# Altium project SiLPA.PrjPCB (part 3 of 5)

## Sheet SiLPA_RF_channel.SchDoc: SiLPA
size 420 x 297 mm; EDA_Number: ARTIQ; Projet: Sampler; Author: G.Kasprowicz; CompanyName: WUT ISE; DrawnBy: G.Kasprowicz; Organization: WUT ISE; Address1: PW ISE; Address2: Nowowiejska 15/19 00-665 Warsaw; Address3: gkasprow@gmail.com; DocumentNumber: 3; Revision: 2; SheetNumber: 3; SheetTotal: 8; ModifiedBy: -; CheckedDate: -; Title2: Power stage; DivGrp: WUT ISE; Designer: G.Kasprowicz; ModifiedDate: -; ProjectName: Sensor Box
Used 2 times, as channels U_SiLPA_RF_channel0, U_SiLPA_RF_channel1. Parts and nets are listed once, with the designators drawn on the sheet.
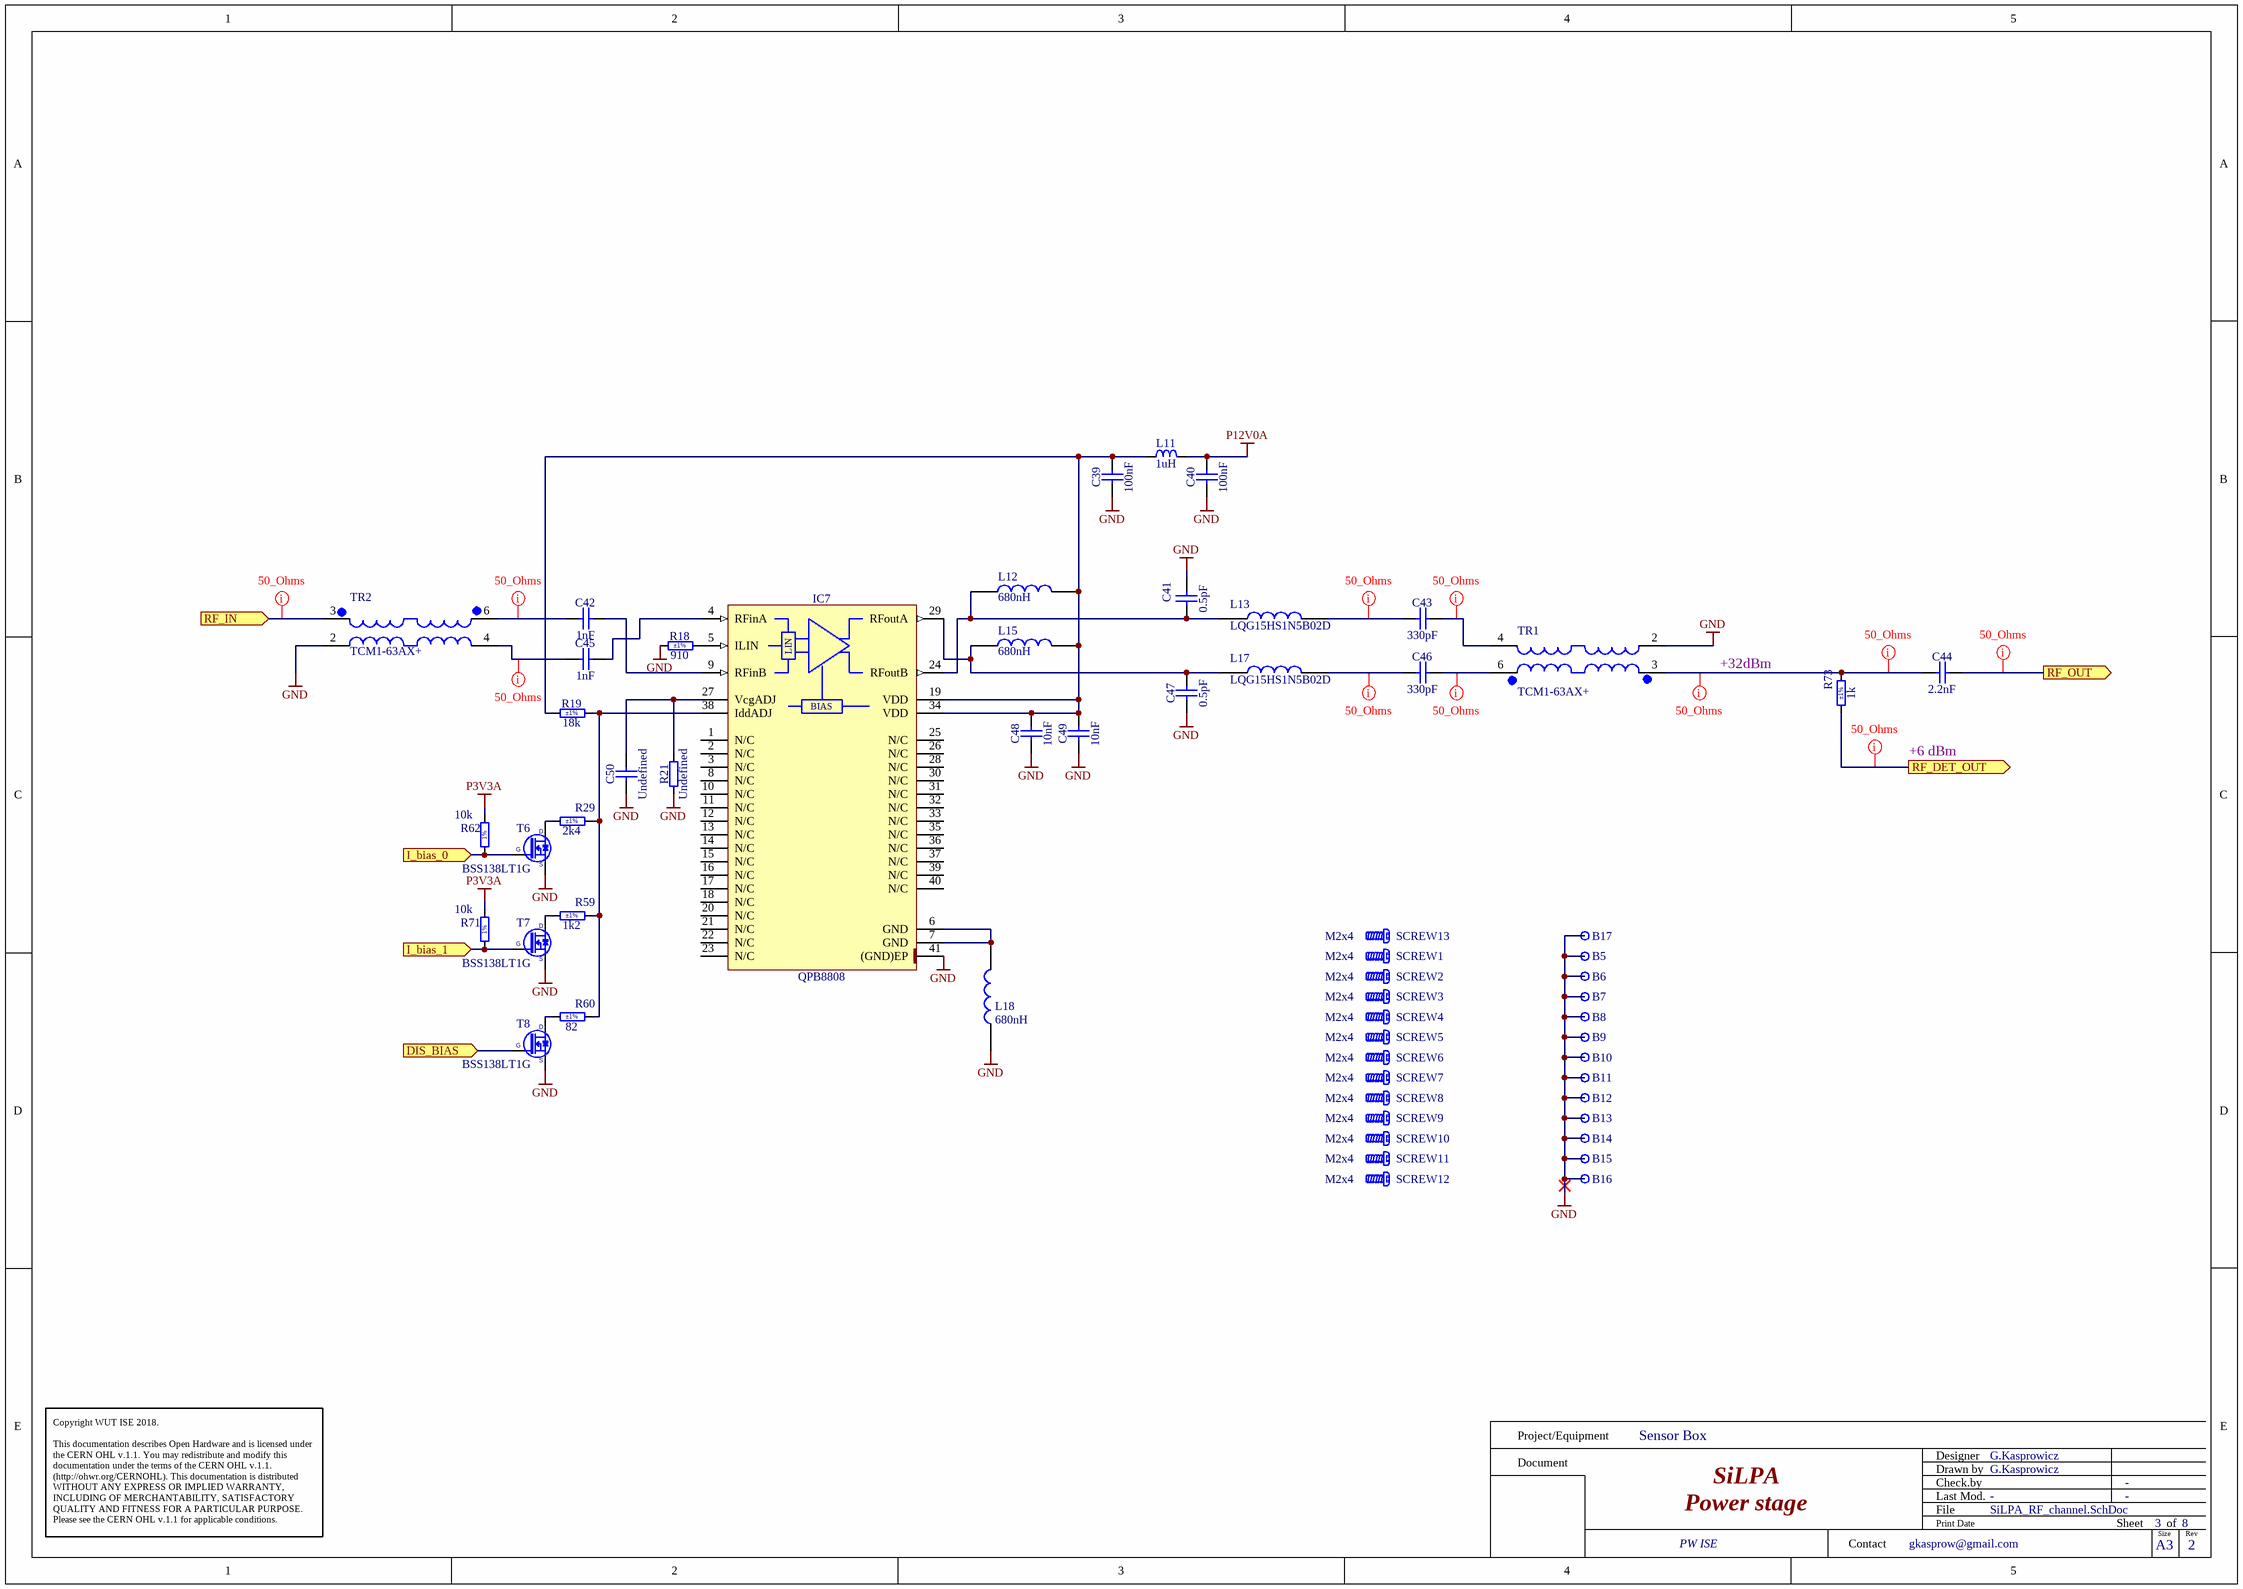
[diagram p3: SiLPA_RF_channel.SchDoc]

### Parts
B5  Plated Hole  [MTG240_400]  (value not drawn)  (no BOM)
B6  Plated Hole  [MTG240_400]  (value not drawn)  (no BOM)
B7  Plated Hole  [MTG240_400]  (value not drawn)  (no BOM)
B8  Plated Hole  [MTG240_400]  (value not drawn)  (no BOM)
B9  Plated Hole  [MTG240_400]  (value not drawn)  (no BOM)
B10  Plated Hole  [MTG240_400]  (value not drawn)  (no BOM)
B11  Plated Hole  [MTG240_400]  (value not drawn)  (no BOM)
B12  Plated Hole  [MTG240_400]  (value not drawn)  (no BOM)
B13  Plated Hole  [MTG240_400]  (value not drawn)  (no BOM)
B14  Plated Hole  [MTG240_400]  (value not drawn)  (no BOM)
B15  Plated Hole  [MTG240_400]  (value not drawn)  (no BOM)
B16  Plated Hole  [MTG240_400]  (value not drawn)  (no BOM)
B17  Plated Hole  [MTG240_400]  (value not drawn)  (no BOM)
C39  100nF  [CAPC1608X87N]
C40  100nF  [CAPC1608X87N]
C41  0.5pF  [CAPC1608X87N]
C42  1nF  [CAPC1608X90N]
C43  330pF  [CAPC1608X87N]
C44  2.2nF  [CAPC1608X87N]
C45  1nF  [CAPC1608X90N]
C46  330pF  [CAPC1608X87N]
C47  0.5pF  [CAPC1608X87N]
C48  10nF  [CAPC1608X87N]
C49  10nF  [CAPC1608X87N]
C50  Undefined  [CAPC1608X90N]
IC7  QPB8808  [QFN50P500X700X80-41N-R360X560]
L11  1uH  [INDC2012X110N]
L12  680nH  [0603AF681XJRW]
L13  LQG15HS1N5B02D  [LQG15WH0N7B02D]
L15  680nH  [0603AF681XJRW]
L17  LQG15HS1N5B02D  [LQG15WH0N7B02D]
L18  680nH  [0603AF681XJRW]
R18  910  Tolerance: ±1%  [RESC1608X55N]
R19  18k  Tolerance: ±1%  [RESC1005X40N]
R21  Undefined  [RESC1608X55N]
R29  2k4  Tolerance: ±1%  [RESC1005X40N]
R59  1k2  Tolerance: ±1%  [RESC1005X40N]
R60  82  Tolerance: ±1%  [RESC1005X40N]
R62  10k  [RESC1005X40N]
R71  10k  [RESC1005X40N]
R73  1k  Tolerance: ±1%  [RESC3216X65N]
SCREW1  M2x4  [BOSSARD_BN5687-3061579_v]
SCREW2  M2x4  [BOSSARD_BN5687-3061579_v]
SCREW3  M2x4  [BOSSARD_BN5687-3061579_v]
SCREW4  M2x4  [BOSSARD_BN5687-3061579_v]
SCREW5  M2x4  [BOSSARD_BN5687-3061579_v]
SCREW6  M2x4  [BOSSARD_BN5687-3061579_v]
SCREW7  M2x4  [BOSSARD_BN5687-3061579_v]
SCREW8  M2x4  [BOSSARD_BN5687-3061579_v]
SCREW9  M2x4  [BOSSARD_BN5687-3061579_v]
SCREW10  M2x4  [BOSSARD_BN5687-3061579_v]
SCREW11  M2x4  [BOSSARD_BN5687-3061579_v]
SCREW12  M2x4  [BOSSARD_BN5687-3061579_v]
SCREW13  M2x4  [BOSSARD_BN5687-3061579_v]
T6  BSS138LT1G  [SOT95P240X110-3N]
T7  BSS138LT1G  [SOT95P240X110-3N]
T8  BSS138LT1G  [SOT95P240X110-3N]
TR1  TCM1-63AX+  [XFMR_TCM1-63AX+]
TR2  TCM1-63AX+  [XFMR_TCM1-63AX+]

### Ports
DIS_BIAS (in), I_bias_0 (in), I_bias_1 (in), RF_DET_OUT (out), RF_IN (in), RF_OUT (out)

### Nets
GND: B5.1 B6.1 B7.1 B8.1 B9.1 B10.1 B11.1 B12.1 B13.1 B14.1 B15.1 B16.1 B17.1 C39.1 C40.1 C41.2 C47.1 C48.1 C49.1 C50.1 IC7.41((GND)EP) L18.1 R18.1 R21.1 T6.2(S) T7.2(S) T8.2(S) TR1.2 TR2.2
P3V3A: R62.2 R71.2
P12V0A: C40.2 L11.2
DIS_BIAS: T8.1(G) ; port DIS_BIAS
I_bias_0: R62.1 T6.1(G) ; port I_bias_0
I_bias_1: R71.1 T7.1(G) ; port I_bias_1
RF_DET_OUT: R73.1 ; port RF_DET_OUT
RF_IN: TR2.3 ; port RF_IN
RF_OUT: C44.2 ; port RF_OUT
NetC39_2: C39.2 C48.2 C49.2 IC7.19(VDD) IC7.34(VDD) L11.1 L12.2 L15.2 R19.1
NetC41_1: C41.1 IC7.24(RFoutB) L12.1 L13.1
NetC42_1: C42.1 TR2.6
NetC42_2: C42.2 IC7.9(RFinB)
NetC43_1: C43.1 L13.2
NetC43_2: C43.2 TR1.4
NetC44_1: C44.1 R73.2 TR1.3
NetC45_1: C45.1 TR2.4
NetC45_2: C45.2 IC7.4(RFinA)
NetC46_1: C46.1 L17.2
NetC46_2: C46.2 TR1.6
NetC47_2: C47.2 IC7.29(RFoutA) L15.1 L17.1
NetC50_2: C50.2 IC7.27(VcgADJ) R21.2
NetIC7_5: IC7.5(ILIN) R18.2
NetIC7_6: IC7.6(GND) IC7.7(GND) L18.2
NetIC7_38: IC7.38(IddADJ) R19.2 R29.2 R59.2 R60.2
NetR29_1: R29.1 T6.3(D)
NetR59_1: R59.1 T7.3(D)
NetR60_1: R60.1 T8.3(D)

Not connected (* = marked no-connect by the designer): IC7 1(N/C) 2(N/C) 3(N/C) 8(N/C) 10(N/C) 11(N/C) 12(N/C) 13(N/C) 14(N/C) 15(N/C) 16(N/C) 17(N/C) 18(N/C) 20(N/C) 21(N/C) 22(N/C) 23(N/C) 25(N/C) 26(N/C) 28(N/C) 30(N/C) 31(N/C) 32(N/C) 33(N/C) 35(N/C) 36(N/C) 37(N/C) 39(N/C) 40(N/C)

### Channels
U_SiLPA_RF_channel0: designators end in A; ports DIS_BIAS=NetIC24A_1 I_bias_0=I_bias0_0 I_bias_1=I_bias0_1 RF_DET_OUT=NetC52A_1 RF_IN=NetC16A_2 RF_OUT=NetC44A_2
U_SiLPA_RF_channel1: designators end in B; ports DIS_BIAS=NetIC24A_1 I_bias_0=I_bias1_0 I_bias_1=I_bias1_1 RF_DET_OUT=NetC52B_1 RF_IN=NetC16B_2 RF_OUT=NetC44B_2

### Layout directives
net class 50_Ohms: NetC16A_2, NetC42A_1, NetC43A_1, NetC43A_2, NetC44A_1, NetC44A_2, NetC45A_1, NetC46A_1, NetC46A_2, NetC52A_1

### Notes on the sheet
- +32dBm
- +6 dBm
- Project/Equipment
- Document
- Designer
- Drawn by
- Check.by
- Copyright WUT ISE 2018.
  This documentation describes Open Hardware and is licensed under the CERN OHL v.1.1. You may redistribute and modify this documentation under the terms of the CERN OHL v.1.1. (http://ohwr.org/CERNOHL). This documentation is distributed WITHOUT ANY EXPRESS OR IMPLIED WARRANTY, INCLUDING OF MERCHANTABILITY, SATISFACTORY QUALITY AND FITNESS FOR A PARTICULAR PURPOSE. Please see the CERN OHL v.1.1 for applicable conditions.
- Contact
- File
- Last Mod.
- Print Date
- Sheet
- Size
- A3
- of
- Rev
- (in symbol QPB8808) LIN; BIAS
- (in symbol R0402_10K_1%_0.0625W_100PPM) 1%

### Library data of the parts
B5-B17 = PLATED_HOLE2.4_PAD4.0: Single Terminal Socket; Part Description: Plated Through Hole: Hole Dia.=2.4mm Pad Dia.=4.0mm; Mounted: No; Part Number: PLATED_HOLE2.4_PAD4.0; Component Type: Standard (No BOM); Pin Count: 1; Family: Plated Hole; Socket: No; SMD: No; Sense: No; Status: None; ComponentHeight: 0mm; HelpURL: Undefined; Author: CERN DEM JMW; CreateDate: 10.10.2011; LatestRevisionDate: 10.10.2011; PackageDescription: Plated Through Hole: Hole Dia.=2.4mm Pad Dia.=4.0mm
C39 C40 = CC0603_100NF_50V_10%_X7R: Non-polarised capacitor; Part Description: SMD Multilayer Chip Ceramic Capacitor; Manufacturer: GENERIC; Manufacturer1 Part Number: 223858615649; Voltage: 50V; TC: X7R; Tolerance: ±10%; Part Number: CC0603_100NF_50V_10%_X7R; Component Kind: Standard; Component Type: Standard; Pin Count: 2; Value: 100nF; Status: Preferred; Manufacturer Part Number: CC0603_100NF_50V_10%_X7R; Case: 0603; Mounted: Yes; Socket: No; SMD: Yes; Sense: No; Manufacturer1 Example: PHYCOMP; Manufacturer1 ComponentHeight: 0.87mm; HelpURL: \\cern.ch\dfs\Applications\Altium\Datasheets\CC0603_X7R_PHYCOMP.pdf; Author: CERN DEM JLC; CreateDate: 03.12.2007; LatestRevisionDate: 03.12.2007
C41 C47 = CC0603_0.5PF_50V_WALSIN_HH18N0R5B500CT: Non-polarised capacitor; Part Description: SMD Multilayer Chip Ceramic Capacitor; Manufacturer: GENERIC; Voltage: 50V; TC: X7R; Tolerance: ±20%; Part Number: CC0603_0.5PF_50V; Component Kind: Standard; Component Type: Standard; Pin Count: 2; Value: 0.5pF; Status: None; Manufacturer Part Number: HH18N0R5B500CT; Case: 0603; Mounted: Yes; Socket: No; SMD: Yes; Sense: No; CreateDate: 22.06.2025; LatestRevisionDate: 22.06.2025; Manufacturer1 Example: WALSIN; Manufacturer1 Part Number: HH18N0R5B500CT; Manufacturer1 ComponentHeight: 0.9mm
C42 C45 = CC0603_1NF_50V_1%_NP0: Non-polarised capacitor; Part Description: SMD Multilayer Chip Ceramic Capacitor; Manufacturer: GENERIC; Manufacturer1 Part Number: 06035A102FAT2A; Voltage: 50V; TC: C0G/NP0; Tolerance: ±1%; Part Number: CC0603_1NF_50V_1%_NP0; Component Kind: Standard; Component Type: Standard; Pin Count: 2; Value: 1nF; Status: None; Manufacturer Part Number: CC0603_1NF_50V_1%_NP0; Case: 0603; Mounted: Yes; Socket: No; SMD: Yes; Sense: No; Manufacturer1 Example: AVX; Manufacturer1 ComponentHeight: 0.9mm; HelpURL: \\cern.ch\dfs\Applications\Altium\Datasheets\CC0603_C0G_AVX.pdf; Author: CERN DEM JLC; CreateDate: 15.06.2017; LatestRevisionDate: 15.06.2017
C43 C46 = CC0603_330PF_50V_1%_NP0: Non-polarised capacitor; Part Description: SMD Multilayer Chip Ceramic Capacitor; Manufacturer: GENERIC; Manufacturer1 Part Number: 223886718331; Voltage: 50V; TC: C0G/NP0; Tolerance: ±1%; Part Number: CC0603_330PF_50V_1%_NP0; Component Kind: Standard; Component Type: Standard; Pin Count: 2; Value: 330pF; Status: None; Manufacturer Part Number: CC0603_330PF_50V_1%_NP0; Case: 0603; Mounted: Yes; Socket: No; SMD: Yes; Sense: No; Manufacturer1 Example: PHYCOMP; Manufacturer1 ComponentHeight: 0.87mm; HelpURL: \\cern.ch\dfs\Applications\Altium\Datasheets\CC0603_NP0_PHYCOMP.pdf; Author: CERN DEM MR; CreateDate: 06.09.2017; LatestRevisionDate: 06.09.2017
C44 = CC0603_2.2NF_50V_5%_C0G: Non-polarised capacitor; Manufacturer: GENERIC; Part Description: SMD Multilayer Chip Ceramic Capacitor; Manufacturer1 Part Number: C1608C0G1H222J080AA; Voltage: 50V; TC: C0G/NP0; Tolerance: ±5%; Value: 2.2nF; Manufacturer Part Number: CC0603_2.2NF_50V_5%_C0G; Part Number: CC0603_2.2NF_50V_5%_C0G; Component Kind: Standard; Component Type: Standard; Pin Count: 2; Status: Preferred; Case: 0603; Mounted: Yes; Socket: No; SMD: Yes; Sense: No; Manufacturer1 Example: TDK; Manufacturer1 ComponentHeight: 0.9mm; HelpURL: \\cern.ch\dfs\Applications\Altium\Datasheets\CC0603_C0G_TDK_C.pdf; Author: CERN DEM JMW; CreateDate: 23.06.2014; LatestRevisionDate: 23.06.2014
C48 C49 = CC0603_10NF_50V_10%_X7R: Non-polarised capacitor; Part Description: SMD Multilayer Chip Ceramic Capacitor; Manufacturer: GENERIC; Manufacturer1 Part Number: 223858615636; Voltage: 50V; TC: X7R; Tolerance: ±10%; Part Number: CC0603_10NF_50V_10%_X7R; Component Kind: Standard; Component Type: Standard; Pin Count: 2; Value: 10nF; Status: Preferred; Manufacturer Part Number: CC0603_10NF_50V_10%_X7R; Case: 0603; Mounted: Yes; Socket: No; SMD: Yes; Sense: No; Manufacturer1 Example: PHYCOMP; Manufacturer1 ComponentHeight: 0.87mm; HelpURL: \\cern.ch\dfs\Applications\Altium\Datasheets\CC0603_X7R_PHYCOMP.pdf; Author: CERN DEM JLC; CreateDate: 03.12.2007; LatestRevisionDate: 03.12.2007
C50 = CC0603_NO-VALUE: Non-polarised capacitor; Part Description: Reserved Footprint For 0603(1608) Chip Ceramic Capacitor; Mounted: No; Part Number: CC0603_NO-VALUE; Component Kind: Standard; Component Type: Standard; Pin Count: 2; Value: Undefined; Status: None; Manufacturer: Undefined; Manufacturer Part Number: CC0603_NO-VALUE; Case: 0603; Socket: No; SMD: Yes; Sense: No; Manufacturer1 ComponentHeight: 0.9mm; HelpURL: Undefined; Author: CERN DEM MR; CreateDate: 22.11.2016; LatestRevisionDate: 22.11.2016
IC7 = QPB8808: 20 dB CATV +12V Power Doubler; Manufacturer: QORVO; PressFit: No; Bonding: No; Part Number: QPB8808; Component Kind: Standard; Component Type: Standard; Device: QPB8808; PackageDescription: QFN, 0.50mm Pitch, Square; 40 Pin, 5.00mm L X 7.00mm W X 0.80mm H body (w/Thermal Tab 3.60 X 5.60mm), IPC Medium Density; Part Description: 20 dB CATV +12V Power Doubler; Manufacturer Part Number: QPB8808; Pin Count: 41; Case: QFN40; Mounted: Yes; Socket: No; SMD: Yes; Sense: No; ComponentHeight: 0.8mm; Author: CERN DEM BC; HelpURL: \\cern.ch\dfs\Applications\Altium\Datasheets\QPB8808.pdf; CreateDate: 19.04.2021; LatestRevisionDate: 19.04.2021
L11 = IND0805_1UH_20%_WURTH_74479775210: Inductor; Part Description: SMD-Power Inductance (WE-PMI Series); Manufacturer: WURTH ELEKTRONIK; Power: 800mA; Resistance: 0.1R; Tolerance: ±20%; Part Number: IND0805_1UH_20%_WURTH_74479775210; Component Kind: Standard; Component Type: Standard; Pin Count: 2; Value: 1uH; Status: None; Manufacturer Part Number: 74479775210; Case: 0805; Mounted: Yes; Socket: No; SMD: Yes; Sense: No; ComponentHeight: 1.2mm; HelpURL: \\cern.ch\dfs\Applications\Altium\Datasheets\IND0805_WURTH_74479775210.pdf; Author: CERN DEM JLC; CreateDate: 10.10.2012; LatestRevisionDate: 08.04.2014
L12 L15 L18 = IND0603_COILCRAFT_AF-681XJRW: Fixed Inductors 1608 680nH Unshld 5% 490mA 460mOhms; Part Number: 0603AF-681XJRW; Part Description: RF Inductors - SMD; Resistance: 0.46R; Authors: skuchars; Tolerance: 5%; Footprint: 0603AF-681XJRW; Pin Count: 2; Value: 680nH; Power: 490mA; Manufacturer: COILCRAFT; Manufacturer Part Number: 0603AF-681XJRW; Case: 0603; Mounted: Yes; Socket: No; SMD: Yes; Sense: No; ComponentHeight: 0.91mm; HelpURL: https://www.coilcraft.com/getmedia/d1383945-8e89-4315-a3c0-59c445701e7e/0603af.pdf; CreateDate: 25.06.2025; LatestRevisionDate: 25.06.2025
L13 L17 = LQG15HS1N5B02D: LQG15HS_02 Series Inductor 1.5nH +/-0.1nH 0402 (1005); Part Description: RF Inductors - SMD 1.5nH +-.1nH; Manufacturer: Murata Electronics; Power: 1000mA; Resistance: 0.07; Tolerance: ±0.1nH; Authors: skuchars; Part Number: LQG15HS1N5B02D; Component Kind: Standard; Component Type: Standard; Footprint: LQG15HS1N5B02D; Pin Count: 2; Value: 1.5nH; Status: None; Manufacturer Part Number: LQG15HS1N5B02D; Case: 0402; Mounted: Yes; Socket: No; SMD: Yes; Sense: No; ComponentHeight: 0.6mm; HelpURL: https://search.murata.co.jp/Ceramy/image/img/P02/JELF243B-0010.pdf; CreateDate: 26.06.2025; LatestRevisionDate: 27.06.2025
R18 = R0603_910R_1%_0.1W_100PPM: Resistor - 1%; Part Description: General Purpose Thick Film Chip Resistor; Manufacturer: GENERIC; Manufacturer1 Part Number: NRC06F9100TRF; Power: 0.1W; TC: ±100ppm/°C; PressFit: No; Part Number: R0603_910R_1%_0.1W_100PPM; Component Kind: Standard; Component Type: Standard; Pin Count: 2; Value: 910; Status: Preferred; Manufacturer Part Number: R0603_910R_1%_0.1W_100PPM; Case: 0603; Mounted: Yes; Sense: No; Socket: No; SMD: Yes; Manufacturer1 Example: NIC COMPONENT; Manufacturer1 ComponentHeight: 0.55mm; HelpURL: \\cern.ch\dfs\Applications\Altium\Datasheets\R0603_NIC_NRC.pdf; Author: CERN DEM JLC; CreateDate: 03.12.2007; LatestRevisionDate: 13.03.2008
R19 = R0402_18K_1%_0.0625W_100PPM: Resistor - 1%; Part Description: General Purpose Thick Film Chip Resistor; Manufacturer: GENERIC; Manufacturer1 Part Number: 232270671803L; TC: ±100ppm/°C; PressFit: No; Part Number: R0402_18K_1%_0.0625W_100PPM; Component Kind: Standard; Component Type: Standard; Pin Count: 2; Value: 18k; Status: Not Recommended; Power: 0.0625W; Manufacturer Part Number: R0402_18K_1%_0.0625W_100PPM; Case: 0402; Mounted: Yes; Sense: No; Socket: No; SMD: Yes; Manufacturer1 Example: YAGEO PHYCOMP; Manufacturer1 ComponentHeight: 0.4mm; HelpURL: \\cern.ch\dfs\Applications\Altium\Datasheets\R0402_Phycomp_RC0402.pdf; Author: CERN DEM JLC; CreateDate: 03.12.2007; LatestRevisionDate: 17.10.2012
R21 = R0603_NO-VALUE: Resistor; Part Description: Reserved Footprint For a 0603 (1608) Chip Resistor; PressFit: No; Mounted: No; Part Number: R0603_NO-VALUE; Component Kind: Standard; Component Type: Standard; Pin Count: 2; Value: Undefined; Status: None; Manufacturer: Undefined; Manufacturer Part Number: R0603_NO-VALUE; Case: 0603; Sense: No; Socket: No; SMD: Yes; Manufacturer1 Example: Undefined; Manufacturer1 Part Number: Undefined; Manufacturer1 ComponentHeight: Undefined; HelpURL: Undefined; Author: CERN DEM JLC; CreateDate: 03.12.2007; LatestRevisionDate: 13.03.2008
R29 = R0402_2K4_1%_0.0625W_100PPM: Resistor - 1%; Part Description: General Purpose Thick Film Chip Resistor; Manufacturer: GENERIC; Manufacturer1 Part Number: 232270672402L; TC: ±100ppm/°C; PressFit: No; Part Number: R0402_2K4_1%_0.0625W_100PPM; Component Kind: Standard; Component Type: Standard; Pin Count: 2; Value: 2k4; Status: Not Recommended; Power: 0.0625W; Manufacturer Part Number: R0402_2K4_1%_0.0625W_100PPM; Case: 0402; Mounted: Yes; Sense: No; Socket: No; SMD: Yes; Manufacturer1 Example: YAGEO PHYCOMP; Manufacturer1 ComponentHeight: 0.4mm; HelpURL: \\cern.ch\dfs\Applications\Altium\Datasheets\R0402_Phycomp_RC0402.pdf; Author: CERN DEM JLC; CreateDate: 03.12.2007; LatestRevisionDate: 17.10.2012
R59 = R0402_1K2_1%_0.0625W_100PPM: Resistor - 1%; Part Description: General Purpose Thick Film Chip Resistor; Manufacturer: GENERIC; Manufacturer1 Part Number: 232270671202L; TC: ±100ppm/°C; PressFit: No; Part Number: R0402_1K2_1%_0.0625W_100PPM; Component Kind: Standard; Component Type: Standard; Pin Count: 2; Value: 1k2; Status: Not Recommended; Power: 0.0625W; Manufacturer Part Number: R0402_1K2_1%_0.0625W_100PPM; Case: 0402; Mounted: Yes; Sense: No; Socket: No; SMD: Yes; Manufacturer1 Example: YAGEO PHYCOMP; Manufacturer1 ComponentHeight: 0.4mm; HelpURL: \\cern.ch\dfs\Applications\Altium\Datasheets\R0402_Phycomp_RC0402.pdf; Author: CERN DEM JLC; CreateDate: 03.12.2007; LatestRevisionDate: 17.10.2012
R60 = R0402_82R_1%_0.0625W_100PPM: Resistor - 1%; Part Description: General Purpose Thick Film Chip Resistor; Manufacturer: GENERIC; Manufacturer1 Part Number: 232270678209L; TC: ±100ppm/°C; PressFit: No; Part Number: R0402_82R_1%_0.0625W_100PPM; Component Kind: Standard; Component Type: Standard; Pin Count: 2; Value: 82; Status: Not Recommended; Power: 0.0625W; Manufacturer Part Number: R0402_82R_1%_0.0625W_100PPM; Case: 0402; Mounted: Yes; Sense: No; Socket: No; SMD: Yes; Manufacturer1 Example: YAGEO PHYCOMP; Manufacturer1 ComponentHeight: 0.4mm; HelpURL: \\cern.ch\dfs\Applications\Altium\Datasheets\R0402_Phycomp_RC0402.pdf; Author: CERN DEM JLC; CreateDate: 03.12.2007; LatestRevisionDate: 17.10.2012
R62 R71 = R0402_10K_1%_0.0625W_100PPM: Resistor - 1%; Part Description: General Purpose Thick Film Chip Resistor; Manufacturer: GENERIC; Manufacturer1 Part Number: 232270671003L; TC: ±100ppm/°C; Table: Resistors SMD; Part Number: R0402_10K_1%_0.0625W_100PPM; Component Kind: Standard; Component Type: Standard; Pin Count: 2; Value: 10k; Status: Not recommended; Power: 0.0625W; Tolerance: ±1%; Manufacturer Part Number: R0402_10K_1%_0.0625W_100PPM; Case: 0402; Mounted: Yes; Socket: No; SMD: Yes; Manufacturer1 Example: YAGEO PHYCOMP; Manufacturer1 ComponentHeight: 0.4mm; HelpURL: \\cern.ch\dfs\Applications\Altium\Datasheets\R0402_Phycomp_RC0402.pdf; Author: CERN DEM JLC; CreateDate: 2007-12-03; LatestRevisionDate: 2012-10-17
R73 = R1206_1K_1%_0.25W_100PPM: Resistor - 1%; Part Description: General Purpose Thick Film Chip Resistor; Manufacturer: GENERIC; Manufacturer1 Part Number: NRC12F1001TRF; Power: 0.25W; TC: ±100ppm/°C; PressFit: No; Part Number: R1206_1K_1%_0.25W_100PPM; Component Kind: Standard; Component Type: Standard; Pin Count: 2; Value: 1k; Status: Preferred; Manufacturer Part Number: R1206_1K_1%_0.25W_100PPM; Case: 1206; Mounted: Yes; Sense: No; Socket: No; SMD: Yes; Manufacturer1 Example: NIC COMPONENT; Manufacturer1 ComponentHeight: 0.65mm; HelpURL: \\cern.ch\dfs\Applications\Altium\Datasheets\R1206_NIC_NRC.pdf; Author: CERN DEM JLC; CreateDate: 03.12.2007; LatestRevisionDate: 13.03.2008
SCREW1-SCREW13 = BOSSARD_BN5687-3061579_v: Screw; Part Description: M2 L=4mm Hexalobular Socket Pan Head Screw, Fully Threaded, Stainless Steel A2; Manufacturer Part Number: BN5687 Art.3061579; PressFit: No; Part Number: BOSSARD_BN5687-3061579_v; Component Kind: Standard; Component Type: Mechanical; Pin Count: 0; PackageDescription: M2 L=4mm Hexalobular Socket Pan Head Screw, Fully Threaded - Stainless Steel A2; Mounted: Yes; Socket: No; SMD: No; Sense: No; Status: None; Value: M2x4; Manufacturer: BOSSARD; ComponentHeight: 5.6mm; HelpURL: \\cern.ch\dfs\Applications\Altium\Datasheets\BOSSARD_BN5687-3061579.pdf; Author: CERN DEM JLC; CreateDate: 01.11.2018; LatestRevisionDate: 01.11.2018
T6-T8 = BSS138LT1G: N-CHANNEL MOSFET WITH DIODE; Part Description: 50V 200mA N-Channel Enhancement Mode Field-Effect Transistor; Manufacturer: ON SEMICONDUCTOR; PressFit: No; Bonding: No; Part Number: BSS138LT1G; Component Kind: Standard; Component Type: Standard; Device: BSS138LT1G; PackageDescription: SOT23, 0.95mm Pitch; 3 Pin, 1.40mm W X 3.00mm L X 1.10mm H body, IPC Medium Density; Manufacturer Part Number: BSS138LT1G; Pin Count: 3; Case: SOT23-3; Mounted: Yes; Socket: No; SMD: Yes; Sense: No; ComponentHeight: 1.11mm; HelpURL: \\cern.ch\dfs\Applications\Altium\Datasheets\BSS138LT1G.pdf; Author: CERN DEM JLC; CreateDate: 23.03.2009; LatestRevisionDate: 23.03.2009
TR1 TR2 = TCM1-63AX+: 1:1 CORE & WIRE Transformer, 10 - 6000 MHz, 50Ω; Manufacturer: Mini-Circuits; Power: 0.2W; Authors: skuchars; Manufacturer Part Number: TCM1-63AX+; Part Number: TCM1-63AX+; Component Kind: Standard; Component Type: Standard; Pin Count: 6; Value: 1:1; Status: None; Part Description: 1:1 CORE & WIRE Transformer, 10 - 6000 MHz, 50Ω; Mounted: Yes; Socket: No; Sense: No; SMD: Yes; ComponentHeight: 4.06mm; HelpURL: https://www.minicircuits.com/pdfs/TCM1-63AX+.pdf; CreateDate: 28.09.2025; LatestRevisionDate: 28.09.2025

## Sheet SiLPA_RF_channel_preamp.SchDoc: SiLPA
size 420 x 297 mm; EDA_Number: ARTIQ; Projet: Sampler; Author: G.Kasprowicz; CompanyName: WUT ISE; DrawnBy: G.Kasprowicz; Organization: WUT ISE; Address1: PW ISE; Address2: Nowowiejska 15/19 00-665 Warsaw; Address3: gkasprow@gmail.com; DocumentNumber: 2; Revision: 2; SheetNumber: 2; SheetTotal: 8; ModifiedBy: -; CheckedDate: -; Title2: Premplifier & switch; DivGrp: WUT ISE; Designer: G.Kasprowicz; ModifiedDate: -; ProjectName: Sensor Box
Used 2 times, as channels U_SiLPA_RF_channel_preamp0, U_SiLPA_RF_channel_preamp1. Parts and nets are listed once, with the designators drawn on the sheet.
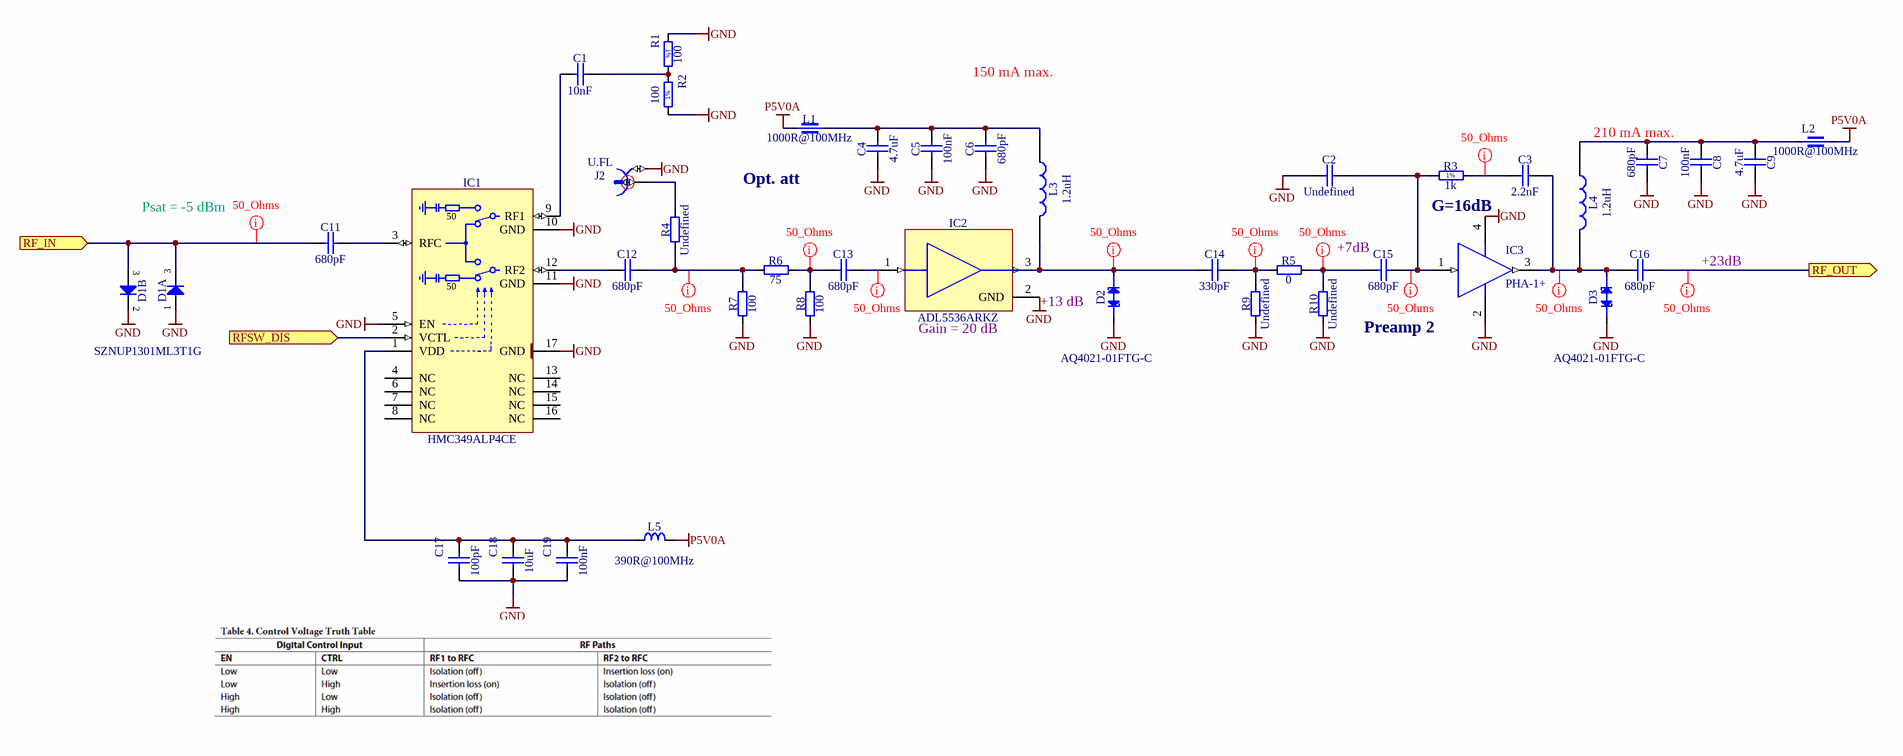
[diagram p4: SiLPA_RF_channel_preamp.SchDoc]

### Parts
C1  10nF  [CAPC1005X55N]
C2  Undefined  [CAPC1608X90N]
C3  2.2nF  [CAPC1608X87N]
C4  4.7uF  [CAPC1709X95N]
C5  100nF  [CAPC1608X87N]
C6  680pF  [CAPC1608X87N]
C7  680pF  [CAPC1608X87N]
C8  100nF  [CAPC1608X87N]
C9  4.7uF  [CAPC1709X95N]
C11  680pF  [CAPC1608X87N]
C12  680pF  [CAPC1608X87N]
C13  680pF  [CAPC1608X87N]
C14  330pF  [CAPC1608X87N]
C15  680pF  [CAPC1608X87N]
C16  680pF  [CAPC1608X87N]
C17  100pF  [CAPC1005X55N]
C18  10uF  [CAPC1608X80N]
C19  100nF  [CAPC1005X55N]
D1  SZNUP1301ML3T1G  [SOT95P240X110-3N]  (value not drawn)  (parts A,B of 2)
D2  AQ4021-01FTG-C  [SOD2513X114N]
D3  AQ4021-01FTG-C  [SOD2513X114N]
IC1  HMC349ALP4CE  [QFN65P400X400X100-17N-S255]
IC2  ADL5536ARKZ  [ANALOG-DEVICES_SOT-89(RK-3)]
IC3  PHA-1+  [MINI-CIRCUITS_DF782]
J2  U.FL  [HIROSE_U.FL-R-SMT-1(10)]
L1  1000R@100MHz  [INDC1608X95N]
L2  1000R@100MHz  [INDC1608X95N]
L3  1.2uH  [ADL2012S1R2MT01]
L4  1.2uH  [ADL2012S1R2MT01]
L5  390R@100MHz  [INDC1608X95N]
R1  100  [RESC1005X40N]
R2  100  [RESC1005X40N]
R3  1k  [RESC1608X55N]
R4  Undefined  [RESC1608X55N]
R5  0  [RESC1005X40N]
R6  75  [RESC1005X40N]
R7  100  [RESC1608X55N]
R8  100  [RESC1608X55N]
R9  Undefined  [RESC1608X55N]
R10  Undefined  [RESC1608X55N]

### Ports
RF_IN (in), RF_OUT (out), RFSW_DIS (in)

### Nets
GND: C2.1 C4.1 C5.1 C6.1 C7.1 C8.1 C9.1 C17.2 C18.1 C19.1 D1.1(A) D1.2(C) D2.1(C) D3.1(C) IC1.5(EN) IC1.10(GND) IC1.11(GND) IC1.17(GND) IC2.2(GND) IC3.2(GND) IC3.4(GND) J2.2 R1.1 R2.1 R7.1 R8.1 R9.1 R10.1
P5V0A: L1.1 L2.2 L5.2
RF_IN: C11.1 D1.3(COMAC) ; port RF_IN
RF_OUT: C16.2 ; port RF_OUT
RFSW_DIS: IC1.2(VCTL) ; port RFSW_DIS
NetC1_1: C1.1 IC1.9(RF1)
NetC1_2: C1.2 R1.2 R2.2
NetC2_2: C2.2 C15.2 IC3.1(RF_IN) R3.1
NetC3_1: C3.1 R3.2
NetC3_2: C3.2 C16.1 D3.2(A) IC3.3(RF_OUT) L4.2
NetC4_2: C4.2 C5.2 C6.2 L1.2 L3.1
NetC7_2: C7.2 C8.2 C9.2 L2.1 L4.1
NetC11_2: C11.2 IC1.3(RFC)
NetC12_1: C12.1 IC1.12(RF2)
NetC12_2: C12.2 R4.2 R6.1 R7.2
NetC13_1: C13.1 R6.2 R8.2
NetC13_2: C13.2 IC2.1(RFIN)
NetC14_1: C14.1 D2.2(A) IC2.3(RFOUT) L3.2
NetC14_2: C14.2 R5.1 R9.2
NetC15_1: C15.1 R5.2 R10.2
NetC17_1: C17.1 C18.2 C19.2 IC1.1(VDD) L5.1
NetJ2_1: J2.1 R4.1

Not connected (* = marked no-connect by the designer): IC1 4(NC) 6(NC) 7(NC) 8(NC) 13(NC) 14(NC) 15(NC) 16(NC)

### Channels
U_SiLPA_RF_channel_preamp0: designators end in A; ports RF_IN=NetC11A_1 RF_OUT=NetC16A_2 RFSW_DIS=RFSW_DIS0
U_SiLPA_RF_channel_preamp1: designators end in B; ports RF_IN=NetC11B_1 RF_OUT=NetC16B_2 RFSW_DIS=RFSW_DIS1

### Layout directives
net class 50_Ohm: NetJ2A_1
net class 50_Ohms: NetC2A_2, NetC3A_1, NetC3A_2, NetC11A_1, NetC12A_2, NetC13A_1, NetC13A_2, NetC14A_1, NetC14A_2, NetC15A_1, NetC16A_2

### Notes on the sheet
- 150 mA max.
- (near C7) 210 mA max.
- (near L1) Opt. att
- Psat = -5 dBm
- (near C15) +7dB
- G=16dB
- +23dB
- (near IC2) Gain = 20 dB
- +13 dB
- Preamp 2
- Project/Equipment
- Document
- Designer
- Drawn by
- Check.by
- Copyright WUT ISE 2018.
  This documentation describes Open Hardware and is licensed under the CERN OHL v.1.1. You may redistribute and modify this documentation under the terms of the CERN OHL v.1.1. (http://ohwr.org/CERNOHL). This documentation is distributed WITHOUT ANY EXPRESS OR IMPLIED WARRANTY, INCLUDING OF MERCHANTABILITY, SATISFACTORY QUALITY AND FITNESS FOR A PARTICULAR PURPOSE. Please see the CERN OHL v.1.1 for applicable conditions.
- Contact
- File
- Last Mod.
- Print Date
- Sheet
- Size
- A3
- of
- Rev
- (in symbol HMC349ALP4CE) 50
- (in symbol R0402_100R_1%_0.0625W_100PPM) 1%
- (in symbol R0603_1K_1%_0.1W_100PPM) 1%

### Library data of the parts
C1 = CC0402_10NF_16V_10%_X7R: Non-polarised capacitor; Part Description: SMD Multilayer Chip Ceramic Capacitor; Manufacturer: GENERIC; Manufacturer1 Part Number: 223878715636; Voltage: 16V; TC: X7R; Tolerance: ±10%; Part Number: CC0402_10NF_16V_10%_X7R; Component Kind: Standard; Component Type: Standard; Pin Count: 2; Value: 10nF; Status: Not Recommended; Manufacturer Part Number: CC0402_10NF_16V_10%_X7R; Case: 0402; Mounted: Yes; Socket: No; SMD: Yes; Sense: No; Manufacturer1 Example: PHYCOMP; Manufacturer1 ComponentHeight: 0.55mm; HelpURL: \\cern.ch\dfs\Applications\Altium\Datasheets\CC0402_X7R_PHYCOMP.pdf; Author: CERN DEM JLC; CreateDate: 2007-12-03; LatestRevisionDate: 2007-12-03
C2 = CC0603_NO-VALUE: as C50 on sheet SiLPA_RF_channel; Part Number: CC0603_NO-VALUE; Component Kind: Standard; Component Type: Standard; Pin Count: 2; Value: Undefined; Status: None; Manufacturer: Undefined; Manufacturer Part Number: CC0603_NO-VALUE; Case: 0603; Socket: No; SMD: Yes; Sense: No; Manufacturer1 ComponentHeight: 0.9mm; HelpURL: Undefined; Author: CERN DEM MR; CreateDate: 22.11.2016; LatestRevisionDate: 22.11.2016
C3 = CC0603_2.2NF_50V_5%_C0G: Non-polarised capacitor; Part Description: SMD Multilayer Chip Ceramic Capacitor; Manufacturer: GENERIC; Manufacturer1 Part Number: C1608C0G1H222J080AA; Voltage: 50V; TC: C0G/NP0; Tolerance: ±5%; Part Number: CC0603_2.2NF_50V_5%_C0G; Component Kind: Standard; Component Type: Standard; Pin Count: 2; Value: 2.2nF; Status: Preferred; Manufacturer Part Number: CC0603_2.2NF_50V_5%_C0G; Case: 0603; Mounted: Yes; Socket: No; SMD: Yes; Sense: No; Manufacturer1 Example: TDK; Manufacturer1 ComponentHeight: 0.9mm; HelpURL: \\cern.ch\dfs\Applications\Altium\Datasheets\CC0603_C0G_TDK_C.pdf; Author: CERN DEM JMW; CreateDate: 23.06.2014; LatestRevisionDate: 23.06.2014
C4 C9 = CC0603_4.7UF_16V_10%_X5R: Non-polarised capacitor; Manufacturer: GENERIC; Part Description: SMD Multilayer Chip Ceramic Capacitor; Manufacturer1 Part Number: EMK107ABJ475KA-T; Voltage: 16V; TC: X5R; Tolerance: ±10%; Value: 4.7uF; Manufacturer Part Number: CC0603_4.7UF_16V_10%_X5R; Part Number: CC0603_4.7UF_16V_10%_X5R; Component Kind: Standard; Component Type: Standard; Pin Count: 2; Status: None; Case: 0603; Mounted: Yes; Socket: No; SMD: Yes; Sense: No; Manufacturer1 Example: TAIYO YUDEN; Manufacturer1 ComponentHeight: 0.95mm; HelpURL: \\cern.ch\dfs\Applications\Altium\Datasheets\CC0603_X7R_TAIYO-YUDEN_HIGH-VALUE.pdf; Author: CERN DEM JLC; CreateDate: 16.12.2013; LatestRevisionDate: 16.09.2014
C5 C8 = CC0603_100NF_50V_10%_X7R: Non-polarised capacitor; Manufacturer: GENERIC; Part Description: SMD Multilayer Chip Ceramic Capacitor; Manufacturer1 Part Number: 223858615649; Voltage: 50V; TC: X7R; Tolerance: ±10%; Value: 100nF; Manufacturer Part Number: CC0603_100NF_50V_10%_X7R; Part Number: CC0603_100NF_50V_10%_X7R; Component Kind: Standard; Component Type: Standard; Pin Count: 2; Status: Preferred; Case: 0603; Mounted: Yes; Socket: No; SMD: Yes; Sense: No; Manufacturer1 Example: PHYCOMP; Manufacturer1 ComponentHeight: 0.87mm; HelpURL: \\cern.ch\dfs\Applications\Altium\Datasheets\CC0603_X7R_PHYCOMP.pdf; Author: CERN DEM JLC; CreateDate: 03.12.2007; LatestRevisionDate: 03.12.2007
C6 C11-C13 = CC0603_680PF_50V_5%_NP0: Non-polarised capacitor; Part Description: SMD Multilayer Chip Ceramic Capacitor; Manufacturer: GENERIC; Manufacturer1 Part Number: 223886715681; Voltage: 50V; TC: C0G/NP0; Tolerance: ±5%; Part Number: CC0603_680PF_50V_5%_NP0; Component Kind: Standard; Component Type: Standard; Pin Count: 2; Value: 680pF; Status: Preferred; Manufacturer Part Number: CC0603_680PF_50V_5%_NP0; Case: 0603; Mounted: Yes; Socket: No; SMD: Yes; Sense: No; Manufacturer1 Example: PHYCOMP; Manufacturer1 ComponentHeight: 0.87mm; HelpURL: \\cern.ch\dfs\Applications\Altium\Datasheets\CC0603_NP0_PHYCOMP.pdf; Author: CERN DEM JLC; CreateDate: 03.12.2007; LatestRevisionDate: 03.12.2007
C7 C15 C16 = CC0603_680PF_50V_5%_NP0: Non-polarised capacitor; Manufacturer: GENERIC; Part Description: SMD Multilayer Chip Ceramic Capacitor; Manufacturer1 Part Number: 223886715681; Voltage: 50V; TC: C0G/NP0; Tolerance: ±5%; Value: 680pF; Manufacturer Part Number: CC0603_680PF_50V_5%_NP0; Part Number: CC0603_680PF_50V_5%_NP0; Component Kind: Standard; Component Type: Standard; Pin Count: 2; Status: Preferred; Case: 0603; Mounted: Yes; Socket: No; SMD: Yes; Sense: No; Manufacturer1 Example: PHYCOMP; Manufacturer1 ComponentHeight: 0.87mm; HelpURL: \\cern.ch\dfs\Applications\Altium\Datasheets\CC0603_NP0_PHYCOMP.pdf; Author: CERN DEM JLC; CreateDate: 03.12.2007; LatestRevisionDate: 03.12.2007
C14 = CC0603_330PF_50V_1%_NP0: Non-polarised capacitor; Manufacturer: GENERIC; Part Description: SMD Multilayer Chip Ceramic Capacitor; Manufacturer1 Part Number: 223886718331; Voltage: 50V; TC: C0G/NP0; Tolerance: ±1%; Value: 330pF; Manufacturer Part Number: CC0603_330PF_50V_1%_NP0; Part Number: CC0603_330PF_50V_1%_NP0; Component Kind: Standard; Component Type: Standard; Pin Count: 2; Status: None; Case: 0603; Mounted: Yes; Socket: No; SMD: Yes; Sense: No; Manufacturer1 Example: PHYCOMP; Manufacturer1 ComponentHeight: 0.87mm; HelpURL: \\cern.ch\dfs\Applications\Altium\Datasheets\CC0603_NP0_PHYCOMP.pdf; Author: CERN DEM MR; CreateDate: 06.09.2017; LatestRevisionDate: 06.09.2017
C17 = CC0402_100PF_50V_5%_C0G: Non-polarised capacitor; Part Description: SMD Multilayer Chip Ceramic Capacitor; Manufacturer: GENERIC; Manufacturer1 Part Number: C0402C101J5GACTU; Voltage: 50V; TC: C0G/NP0; Tolerance: ±5%; Part Number: CC0402_100PF_50V_5%_C0G; Component Kind: Standard; Component Type: Standard; Pin Count: 2; Value: 100pF; Status: Preferred; Manufacturer Part Number: CC0402_100PF_50V_5%_C0G; Case: 0402; Mounted: Yes; Socket: No; SMD: Yes; Sense: No; Manufacturer1 Example: KEMET; Manufacturer1 ComponentHeight: 0.55mm; HelpURL: \\cern.ch\dfs\Applications\Altium\Datasheets\CC0805_C0G_KEMET_(Commercial Grade).pdf; Author: CERN DEM JLC; CreateDate: 2007-12-03; LatestRevisionDate: 2015-04-22
C18 = CC0603_10UF_16V_20%_X5R: Non-polarised capacitor; Part Description: SMD Multilayer Chip Ceramic Capacitor; Manufacturer: GENERIC; Manufacturer1 Part Number: GRM188R61C106MA73D; Voltage: 16V; TC: X5R; Tolerance: ±20%; Part Number: CC0603_10UF_16V_20%_X5R; Component Kind: Standard; Component Type: Standard; Pin Count: 2; Value: 10uF; Status: None; Manufacturer Part Number: CC0603_10UF_16V_20%_X5R; Case: 0603; Mounted: Yes; Socket: No; SMD: Yes; Sense: No; Manufacturer1 Example: MURATA; Manufacturer1 ComponentHeight: 0.8mm; HelpURL: \\cern.ch\dfs\Applications\Altium\Datasheets\CC0603_X5R_MURATA_GRM.pdf; Author: CERN DEM MR; CreateDate: 2016-03-02; LatestRevisionDate: 2016-03-02
C19 = CC0402_100NF_16V_10%_X5R: Non-polarised capacitor; Part Description: SMD Multilayer Chip Ceramic Capacitor; Manufacturer: GENERIC; Manufacturer1 Part Number: GRM155R61C104KA88D; Voltage: 16V; TC: X5R; Tolerance: ±10%; Part Number: CC0402_100NF_16V_10%_X5R; Component Kind: Standard; Component Type: Standard; Pin Count: 2; Value: 100nF; Status: None; Manufacturer Part Number: CC0402_100NF_16V_10%_X5R; Case: 0402; Mounted: Yes; Socket: No; SMD: Yes; Sense: No; Manufacturer1 Example: MURATA; Manufacturer1 ComponentHeight: 0.55mm; HelpURL: \\cern.ch\dfs\Applications\Altium\Datasheets\CC0402_X5R_MURATA_GRM.pdf; Author: CERN DEM JLC; CreateDate: 10.12.2013; LatestRevisionDate: 10.12.2013
D1 = D_TVS_SZNUP1301ML3T1G: Low Capacitance Diode Array for ESD Protection in a Single Data Line; Manufacturer: ONSEMI; Voltage: 70V; Power: 215mA; PressFit: No; Bonding: No; Part Number: SZNUP1301ML3T1G; Component Kind: Standard; Component Type: Standard; Device: SZNUP1301ML3T1G; PackageDescription: SOT23 3-Leads, Pitch 0.95mm - Body 1.3x2.9mm, IPC Medium Density; Part Description: Low Capacitance Diode Array for ESD Protection in a Single Data Line; Manufacturer Part Number: SZNUP1301ML3T1G; Pin Count: 3; Case: SOT23; Mounted: Yes; Socket: No; SMD: Yes; Sense: No; ComponentHeight: 1.1mm; HelpURL: \\cern.ch\dfs\Applications\Altium\Datasheets\BAR66.pdf; Author: GK; CreateDate: 18.01.2010; LatestRevisionDate: 05.10.2010
D2 D3 = D_TVS_AQ4021-01FTG-C: 6V Bi-directional,ESD Protection for Transient Voltage Suppressor Diode; Part Description: Bi-directional ESD Protection for Transient Voltage Suppressor Diode; Manufacturer: Littlefuse; Power: 450W; PressFit: No; Bonding: No; Part Number: AQ4021-01FTG-C; Component Kind: Standard; Component Type: Standard; Device: AQ4021-01FTG-C; PackageDescription: SOD-323 Diode; 1.75mm W X 1.30mm L X 1.14mm H Body, IPC Medium Density; Voltage: 6V; Manufacturer Part Number: AQ4021-01FTG-C; Pin Count: 2; Case: SOD323; Mounted: Yes; Socket: No; SMD: Yes; Sense: No; ComponentHeight: 1.14mm; HelpURL: \\cern.ch\dfs\Applications\Altium\Datasheets\CDSOD323-T12C-DSL.pdf; Author: GK; CreateDate: 22.07.2015; LatestRevisionDate: 19.12.2017
IC1 = HMC349ALP4CE: DC-4GHz High Isolation SPDT Non-Reflective Switch; Manufacturer: ANALOG DEVICES; PressFit: No; Bonding: No; Part Number: HMC349ALP4CE; Component Kind: Standard; Component Type: Standard; Device: HMC349ALP4CE; PackageDescription: QFN, 0.65mm pitch,square; 4 pin X 4 pin, 4mm X 4mm X 1mm H body (w/thermal tab 2.55 X 2.55mm),  IPC Medium Density; Part Description: DC-4GHz High Isolation SPDT Non-Reflective Switch; Manufacturer Part Number: HMC349ALP4CE; Pin Count: 17; Case: QFN16; Mounted: Yes; Socket: No; SMD: Yes; Sense: No; ComponentHeight: 1mm; Author: CERN DEM JLC; HelpURL: \\cern.ch\dfs\Applications\Altium\Datasheets\HMC349ALP4CE.pdf; CreateDate: 23.02.2017; LatestRevisionDate: 23.02.2017
IC2 = ADL5536ARKZ: 20MHz to 1GHz IF Gain Block; Manufacturer: ANALOG DEVICES; PressFit: No; Bonding: No; Part Number: ADL5536ARKZ; Component Kind: Standard; Component Type: Standard; Device: ADL5536ARKZ; PackageDescription: SOT89, 1.50mm Pitch; 3-Leads, 2.5mm W X 4.5mm L X 1.6mm H body; Part Description: 20MHz to 1GHz IF Gain Block; Manufacturer Part Number: ADL5536ARKZ; Pin Count: 4; Case: SOT89; Mounted: Yes; Socket: No; SMD: Yes; Sense: No; ComponentHeight: 1.6mm; Author: CERN DEM BC; HelpURL: \\cern.ch\dfs\Applications\Altium\Datasheets\ADL5536ARKZ.pdf; CreateDate: 19.08.2019; LatestRevisionDate: 19.08.2019
IC3 = PHA-1+: Monolithic Amplifier; Part Description: 0.05-6GHz Surface Mount Monolithic Amplifier; Manufacturer: MINI-CIRCUITS; PressFit: No; Bonding: No; Part Number: PHA-1+; Component Kind: Standard; Component Type: Standard; Device: PHA-1+; PackageDescription: MINI-CIRCUITS DF782 Case, 1.50mm pitch; 4 pin, 2.44mm W X 4.49mm L; Manufacturer Part Number: PHA-1+; Pin Count: 4; Mounted: Yes; Socket: No; SMD: Yes; Sense: No; ComponentHeight: 1.6mm; Author: CERN DEM BC; HelpURL: \\cern.ch\dfs\Applications\Altium\Datasheets\PHA-1+.pdf; CreateDate: 22.08.2019; LatestRevisionDate: 22.08.2019
J2 = HIROSE_U.FL-R-SMT-1(10): Part Description: Up to 6GHz Ultra Small Surface Mount Male Coaxial Connectors U.FL Series; Manufacturer: HIROSE (HRS); PressFit: No; Part Number: HIROSE_U.FL-R-SMT-1(10); Component Kind: Standard; Component Type: Standard; Pin Count: 2; Family: U.FL; Mounted: Yes; Socket: No; SMD: Yes; Sense: No; Status: None; Manufacturer Part Number: U.FL-R-SMT-1(10); ComponentHeight: 1.25mm; HelpURL: \\cern.ch\dfs\Applications\Altium\Datasheets\HIROSE_U.FL-R-SMT-1(10).pdf; Author: CERN DEM JLC; CreateDate: 24.03.2010; LatestRevisionDate: 24.03.2010
L1 L2 = IND0603_MURATA_BLM18HE102SN1: Manufacturer: MURATA; Part Description: SMD EMIFIL Suppression Chip Ferrite Bead; Power: 600mA; Resistance: 0.35R; Tolerance: ±25%; Value: 1000R@100MHz; Manufacturer Part Number: BLM18HE102SN1; Part Number: IND0603_MURATA_BLM18HE102SN1; Component Kind: Standard; Component Type: Standard; Pin Count: 2; Status: None; Case: 0603; Mounted: Yes; Socket: No; SMD: Yes; Sense: No; ComponentHeight: 0.95mm; HelpURL: \\cern.ch\dfs\Applications\Altium\Datasheets\IND0603_MURATA_BLM18H.pdf; Author: CERN DEM JLC; CreateDate: 09.12.2013; LatestRevisionDate: 25.10.2018
L3 L4 = ADL2012S-1R2M-T01: 1.2uH Unshielded Drum Core, Wirewound Inductor 550 mA 500mOhm Max 0808 (2012 Metric); Part Number: 810-ADL2012S-1R2MT01; Part Description: Power Inductors - SMD 1.2uH 0.5ohm 20% AEC-Q200; Manufacturer: TDK; Power: 550mA; Resistance: 500mΩ; Tolerance: 20 %; Authors: skuchars; Component Kind: Standard; Component Type: Standard; Pin Count: 2; Value: 1.2uH; Status: None; Manufacturer Part Number: ADL2012S-1R2M-T01; Case: 0808; Mounted: Yes; Socket: No; SMD: Yes; Sense: No; ComponentHeight: 1.75mm; HelpURL: https://product.tdk.com/system/files/dam/doc/product/inductor/inductor/smd/catalog/inductor_automotive_decoupling_adl2012_en.pdf; CreateDate: 26.06.2025; LatestRevisionDate: 26.06.2025
L5 = IND0603_TDK_MPZ1608R391A: Inductor; Part Description: SMT Chip Bead for Power Line; Manufacturer: TDK; Power: 1.2A; Resistance: 0.12R; Tolerance: ±25%; Part Number: IND0603_TDK_MPZ1608R391A; Component Kind: Standard; Component Type: Standard; Pin Count: 2; Value: 390R@100MHz; Status: None; Manufacturer Part Number: MPZ1608R391A; Case: 0603; Mounted: Yes; Socket: No; SMD: Yes; Sense: No; ComponentHeight: 0.95mm; HelpURL: \\cern.ch\dfs\Applications\Altium\Datasheets\IND0603_TDK_MPZ1608.pdf; Author: CERN DEM JLC; CreateDate: 2009-12-02; LatestRevisionDate: 2009-12-02
R1 R2 = R0402_100R_1%_0.0625W_100PPM: Resistor - 1%; Part Description: General Purpose Thick Film Chip Resistor; Manufacturer: GENERIC; Manufacturer1 Part Number: 232270671001L; TC: ±100ppm/°C; PressFit: No; Part Number: R0402_100R_1%_0.0625W_100PPM; Component Kind: Standard; Component Type: Standard; Pin Count: 2; Value: 100; Status: Not Recommended; Power: 0.0625W; Tolerance: ±1%; Manufacturer Part Number: R0402_100R_1%_0.0625W_100PPM; Case: 0402; Mounted: Yes; Sense: No; Socket: No; SMD: Yes; Manufacturer1 Example: YAGEO PHYCOMP; Manufacturer1 ComponentHeight: 0.4mm; HelpURL: \\cern.ch\dfs\Applications\Altium\Datasheets\R0402_Phycomp_RC0402.pdf; Author: CERN DEM JLC; CreateDate: 03.12.2007; LatestRevisionDate: 17.10.2012
R3 = R0603_1K_1%_0.1W_100PPM: Resistor - 1%; Manufacturer: GENERIC; Part Description: General Purpose Thick Film Chip Resistor; Manufacturer1 Part Number: NRC06F1001TRF; Power: 0.1W; TC: ±100ppm/°C; PressFit: No; Value: 1k; Manufacturer Part Number: R0603_1K_1%_0.1W_100PPM; Part Number: R0603_1K_1%_0.1W_100PPM; Component Kind: Standard; Component Type: Standard; Pin Count: 2; Status: Preferred; Tolerance: ±1%; Case: 0603; Mounted: Yes; Sense: No; Socket: No; SMD: Yes; Manufacturer1 Example: NIC COMPONENT; Manufacturer1 ComponentHeight: 0.55mm; HelpURL: \\cern.ch\dfs\Applications\Altium\Datasheets\R0603_NIC_NRC.pdf; Author: CERN DEM JLC; CreateDate: 03.12.2007; LatestRevisionDate: 13.03.2008
R4 R9 R10 = R0603_NO-VALUE: as R21 on sheet SiLPA_RF_channel; Value: Undefined; Manufacturer: Undefined; Manufacturer Part Number: R0603_NO-VALUE; Part Number: R0603_NO-VALUE; Component Kind: Standard; Component Type: Standard; Pin Count: 2; Status: None; Case: 0603; Sense: No; Socket: No; SMD: Yes; Manufacturer1 Example: Undefined; Manufacturer1 Part Number: Undefined; Manufacturer1 ComponentHeight: Undefined; HelpURL: Undefined; Author: CERN DEM JLC; CreateDate: 03.12.2007; LatestRevisionDate: 13.03.2008
R5 R6 = R0402_0R_JUMPER: Resistor; Manufacturer: GENERIC; Part Description: 1A (0.05R Max DC Resistance) Zero Ohm Jumper; Manufacturer1 Part Number: 232270591001L; PressFit: No; Manufacturer Part Number: R0402_0R_JUMPER; Part Number: R0402_0R_JUMPER; Component Kind: Standard; Component Type: Standard; Pin Count: 2; Status: Not Recommended; Case: 0402; Mounted: Yes; Sense: No; Socket: No; SMD: Yes; Manufacturer1 Example: YAGEO PHYCOMP; Manufacturer1 ComponentHeight: 0.4mm; HelpURL: \\cern.ch\dfs\Applications\Altium\Datasheets\R0402_Phycomp_RC0402.pdf; Author: CERN DEM JLC; CreateDate: 03.12.2007; LatestRevisionDate: 17.10.2012
  R5: Value: 0
  R6: Value: 75
R7 R8 = R0603_NO-VALUE: Resistor; Manufacturer: Undefined; Part Description: Reserved Footprint For a 0603 (1608) Chip Resistor; PressFit: No; Mounted: No; Value: 100; Manufacturer Part Number: R0603_NO-VALUE; Part Number: R0603_NO-VALUE; Component Kind: Standard; Component Type: Standard; Pin Count: 2; Status: None; Case: 0603; Sense: No; Socket: No; SMD: Yes; Manufacturer1 Example: Undefined; Manufacturer1 Part Number: Undefined; Manufacturer1 ComponentHeight: Undefined; HelpURL: Undefined; Author: CERN DEM JLC; CreateDate: 03.12.2007; LatestRevisionDate: 13.03.2008